# EAGLE schematic speaker_amp_single (EAGLE 6.3)
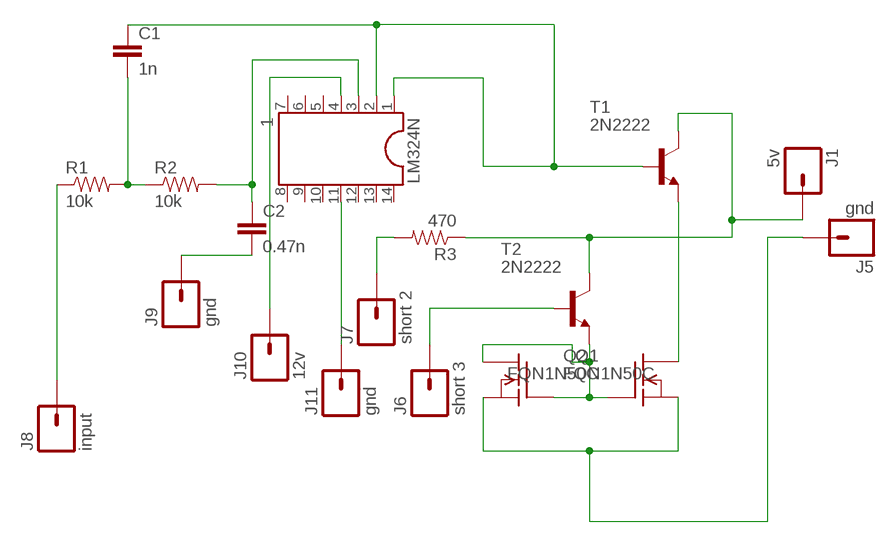
[diagram p0: schematic, sheet 1]

## Parts
C1  1n  CAPPTH  [CAP-PTH-SMALL]
C2  0.47n  CAPPTH  [CAP-PTH-SMALL]
J1  5v  M01PTH  [1X01]
J5  gnd  M01PTH  [1X01]
J6  short 3  M01PTH  [1X01]
J7  short 2  M01PTH  [1X01]
J8  input  M01PTH  [1X01]
J9  gnd  M01PTH  [1X01]
J10  12v  M01PTH  [1X01]
J11  gnd  M01PTH  [1X01]
LM324N  1  DIL14  [DIL14]
Q1  FQN1N50C  [TO92]
Q2  FQN1N50C  [TO92]
R1  10k  RESISTORAXIAL-0.3  [AXIAL-0.3]
R2  10k  RESISTORAXIAL-0.3  [AXIAL-0.3]
R3  470  RESISTORAXIAL-0.3  [AXIAL-0.3]
T1  2N2222  [TO92-EBC-OVAL]
T2  2N2222  [TO92-EBC-OVAL]

## Nets
N$1: C1.2 R1.P$2 R2.P$1
N$2: C2.1 LM324N.3 R2.P$2
N$3: C1.1 LM324N.1 LM324N.2 T1.B
N$4: Q2.2(D) T1.E
N$5: Q1.1(G) Q1.2(D) Q2.1(G) T2.E
N$6: J7.1 R3.P$2
N$7: J11.1 LM324N.11
N$8: J6.1 T2.B
N$9: J8.1 R1.P$1
N$10: J1.1 R3.P$1 T1.C T2.C
N$11: C2.2 J9.1
N$12: J5.1 Q1.3(S) Q2.3(S)
N$14: J10.1 LM324N.4
Unconnected: LM324N.5 LM324N.6 LM324N.7 LM324N.8 LM324N.9 LM324N.10 LM324N.12 LM324N.13 LM324N.14

## Library data of the parts
C1 C2 = SparkFun-Passives:CAP: Capacitor Standard 0603 ceramic capacitor, and 0.1" leaded capacitor.
J1 J5-J11 = SparkFun-Connectors:M01: Header 1 Standard 1-pin 0.1" header. Use with straight break away headers (SKU : PRT-00116), right angle break away headers (PRT-00553), swiss pins (PRT-00743), machine pins (PRT-00117), and female headers (PRT-00115). SMTSO-256-ET is a "flush mount" nut for a 4-40 screw. The older package used to be too tight, and did not allow it to sit properly thru the drill hit. The latest (0.165DIA) fits nice and snug.
LM324N = ic-package:DIL14: Dual In Line / Socket
Q1 Q2 = adafruit:FQN1N50C: N-Channel Enhancement MOSFET 500V, 0.4A, 6.0 Ohm
R1-R3 = SparkFun-Resistors:RESISTOR: Resistor Basic schematic elements and footprints for 0603, 1206, and PTH resistors.
T1 T2 = adafruit:2N2222: NPN TRANSISTOR Big oval pads